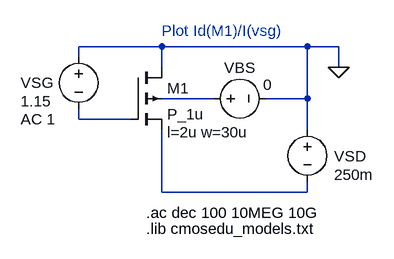
[diagram p0: schematic Tab9_1_ftp.asc]
Tab9_1_ftp.asc, the LTspice schematic file:
Version 4
SHEET 1 1184 688
WIRE 320 96 320 80
WIRE 320 192 320 176
WIRE 400 192 320 192
WIRE 448 80 320 80
WIRE 448 112 448 80
WIRE 448 304 448 208
WIRE 528 160 448 160
WIRE 672 80 448 80
WIRE 672 160 608 160
WIRE 672 160 672 80
WIRE 672 208 672 160
WIRE 672 304 448 304
WIRE 672 304 672 288
WIRE 720 80 672 80
WIRE 720 112 720 80
FLAG 720 112 0
SYMBOL voltage 320 80 R0
WINDOW 0 -89 56 Left 0
WINDOW 3 -89 84 Left 0
WINDOW 123 -89 112 Left 0
WINDOW 39 0 0 Left 0
SYMATTR InstName VSG
SYMATTR Value 1.15
SYMATTR Value2 AC 1
SYMBOL voltage 672 192 R0
WINDOW 123 0 0 Left 0
WINDOW 39 0 0 Left 0
WINDOW 0 41 57 Left 0
WINDOW 3 41 85 Left 0
SYMATTR InstName VSD
SYMATTR Value 250m
SYMBOL voltage 512 160 M90
WINDOW 0 -32 56 VBottom 0
WINDOW 3 -6 99 VBottom 0
WINDOW 123 0 0 Left 0
WINDOW 39 0 0 Left 0
SYMATTR InstName VBS
SYMATTR Value 0
SYMBOL pmos4 400 112 R0
WINDOW 123 56 100 Left 0
SYMATTR Value2 l=2u w=30u
SYMATTR InstName M1
SYMATTR Value P_1u
TEXT 424 336 Left 0 !.ac dec 100 10MEG 10G
TEXT 424 360 Left 0 !.lib cmosedu_models.txt
TEXT 448 56 Left 0 ;Plot Id(M1)/I(vsg)

The netlist it stands for:
* Tab9_1_ftp.asc
VSG 0 N001 1.15 AC 1
VSD 0 N002 250m
VBS N003 0 0
M1 0 N001 N002 N003 P_1u l=2u w=30u
.model NMOS NMOS
.model PMOS PMOS
.lib standard.mos
.ac dec 100 10MEG 10G
.lib cmosedu_models.txt
* Plot Id(M1)/I(vsg)
.backanno
.end